# EAGLE design greenshield (EAGLE 6.5.0)
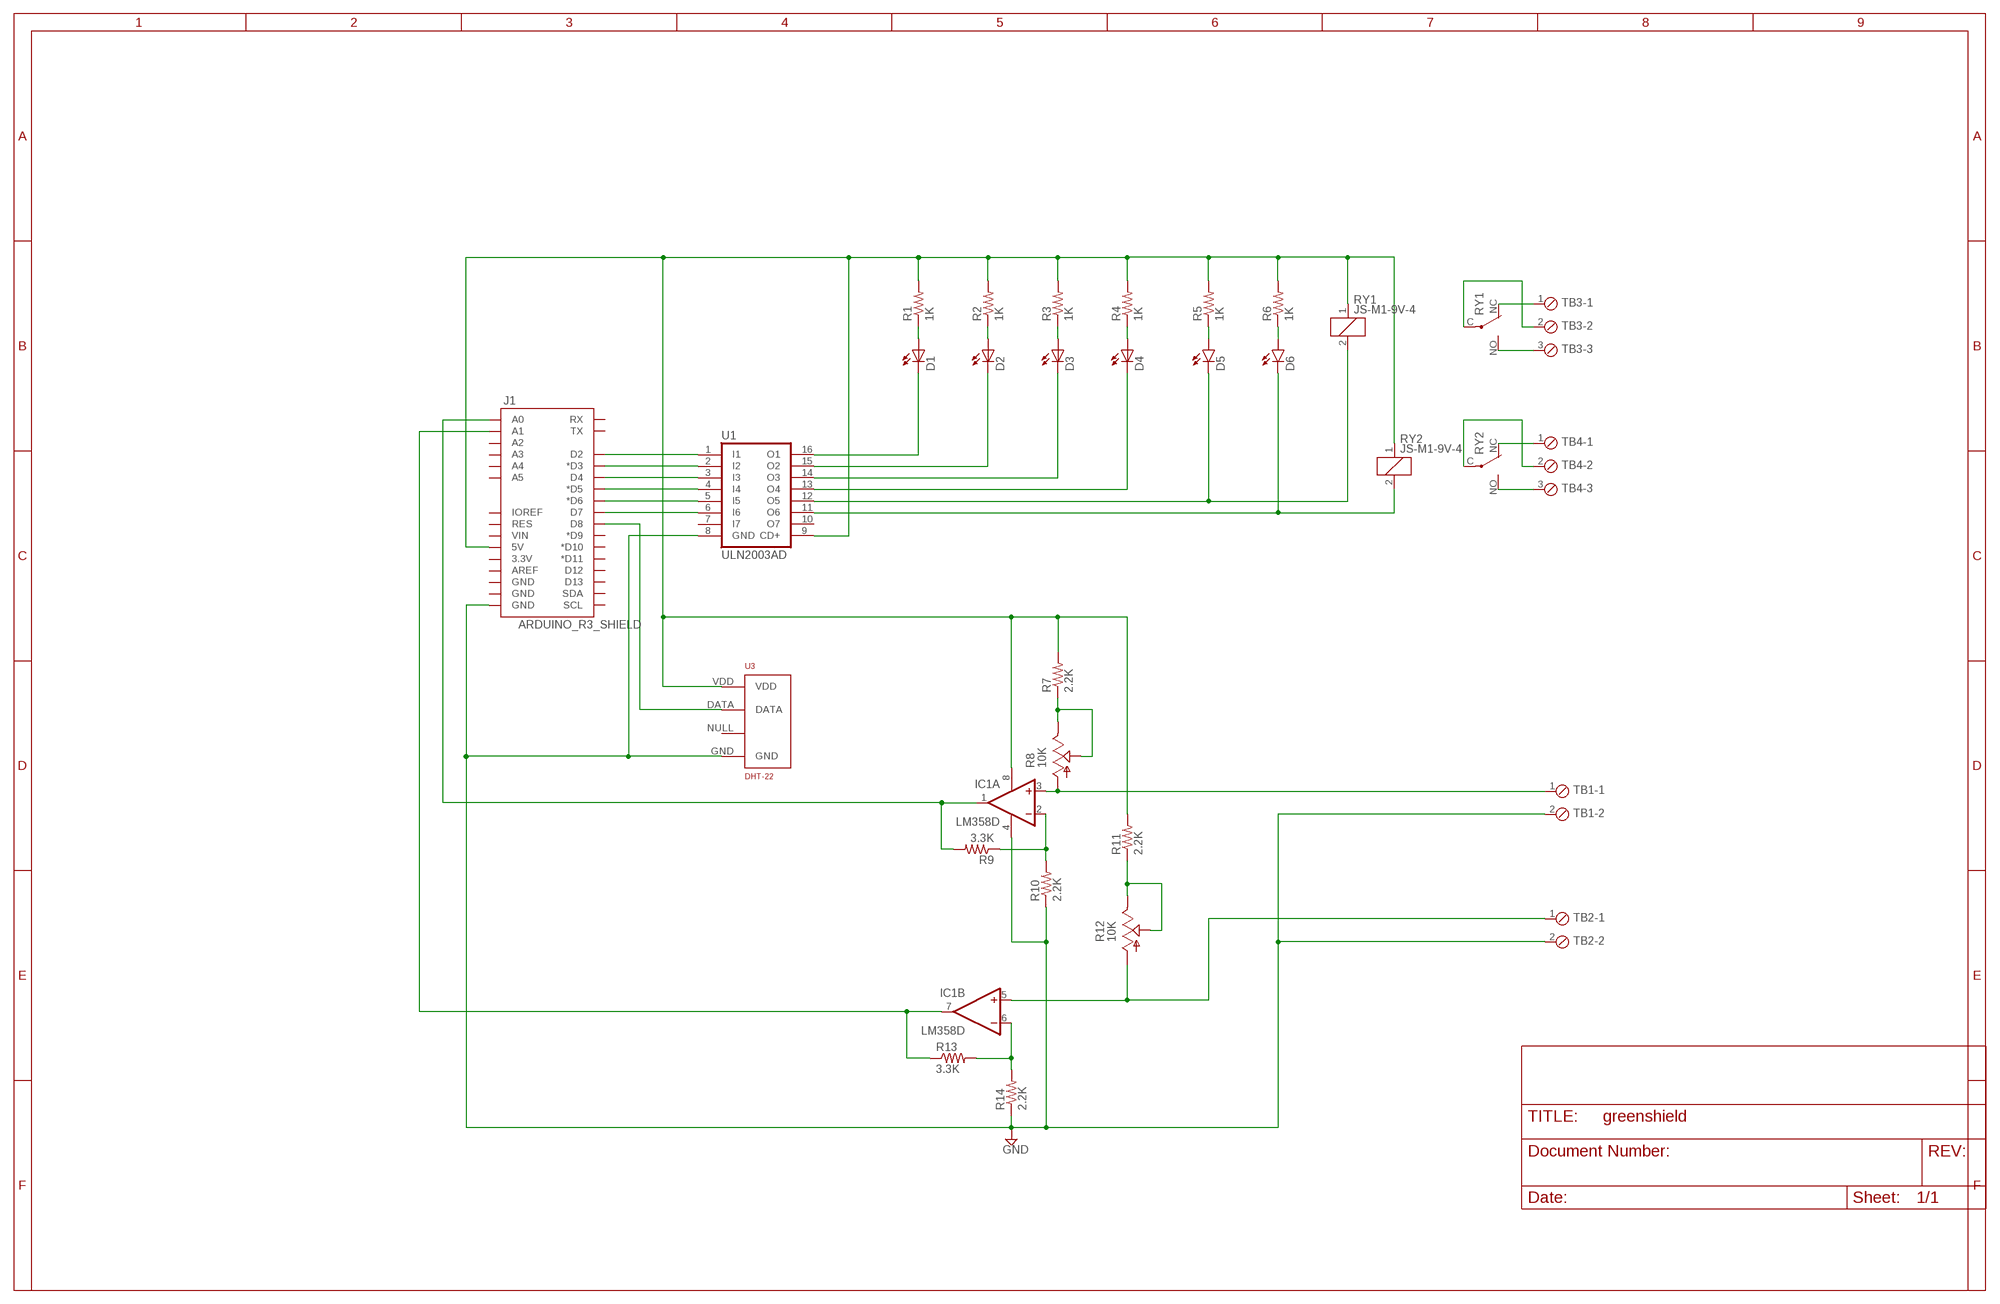
[diagram p0: schematic, sheet 1]

## Parts
D1  LED3MM  [LED3MM]
D2  LED3MM  [LED3MM]
D3  LED3MM  [LED3MM]
D4  LED3MM  [LED3MM]
D5  LED3MM  [LED3MM]
D6  LED3MM  [LED3MM]
IC1  LM358D  [SO08]
J1  ARDUINO_R3_SHIELD  [UNO_R3_SHIELD]
R1  1K  RESISTOR0805-RES  [0805]
R2  1K  RESISTOR0805-RES  [0805]
R3  1K  RESISTOR0805-RES  [0805]
R4  1K  RESISTOR0805-RES  [0805]
R5  1K  RESISTOR0805-RES  [0805]
R6  1K  RESISTOR0805-RES  [0805]
R7  2.2K  RESISTOR0805-RES  [0805]
R8  10K  TRIM_US-S64W  [S64W]
R9  3.3K  RESISTOR0805-RES  [0805]
R10  2.2K  RESISTOR0805-RES  [0805]
R11  2.2K  RESISTOR0805-RES  [0805]
R12  10K  TRIM_US-S64W  [S64W]
R13  3.3K  RESISTOR0805-RES  [0805]
R14  2.2K  RESISTOR0805-RES  [0805]
RY1  JS-M1-9V-4  [JS-M]
RY2  JS-M1-9V-4  [JS-M]
TB1  MPT2  [2POL254]
TB2  MPT2  [2POL254]
TB3  MPT3  [3POL254]
TB4  MPT3  [3POL254]
U1  ULN2003AD  [SO16]
U3  DHT-22  RHT03_DHT-22_AM2302  [RHT03_DHT-22]

## Nets
GND: IC1.4(P:V-) J1.GND@0(GND) R10.1 R14.1 TB1.2 TB2.2 U1.8(GND) U3.GND
N$1: J1.D2 U1.1(I1)
N$2: J1.D3(*D3) U1.2(I2)
N$3: J1.D4 U1.3(I3)
N$4: D6.K(C) RY2.2 U1.11(O6)
N$5: J1.D5(*D5) U1.4(I4)
N$6: J1.D6(*D6) U1.5(I5)
N$7: J1.D7 U1.6(I6)
N$8: D5.K(C) RY1.2 U1.12(O5)
N$9: RY1.NC(2:O) TB3.1
N$10: D1.K(C) U1.16(O1)
N$11: D6.A R6.1
N$12: D2.K(C) U1.15(O2)
N$13: D3.K(C) U1.14(O3)
N$14: D4.K(C) U1.13(O4)
N$15: D5.A R5.1
N$16: RY1.NO(2:S) TB3.3
N$17: D1.A R1.1
N$18: D2.A R2.1
N$19: D3.A R3.1
N$20: D4.A R4.1
N$21: RY2.NC(2:O) TB4.1
N$22: RY2.NO(2:S) TB4.3
N$23: RY2.C(2:P) TB4.2
N$24: RY1.C(2:P) TB3.2
N$25: IC1.8(P:V+) J1.5V R1.2 R2.2 R3.2 R4.2 R5.2 R6.2 R7.2 R11.2 RY1.1 RY2.1 U1.9(CD+) U3.VDD
N$26: R7.1 R8.E R8.S
N$27: R11.1 R12.E R12.S
N$28: IC1.5(B:+IN) R12.A TB2.1
N$29: IC1.6(B:-IN) R13.2 R14.2
N$30: IC1.7(B:OUT) J1.A1 R13.1
N$31: J1.D8 U3.DATA
N$32: IC1.2(A:-IN) R9.1 R10.2
N$33: IC1.1(A:OUT) J1.A0 R9.2
N$34: IC1.3(A:+IN) R8.A TB1.1
Unconnected: J1.3.3V J1.A2 J1.A3 J1.A4 J1.A5 J1.AREF J1.D9(*D9) J1.D10(*D10) J1.D11(*D11) J1.D12 J1.D13 J1.GND@1(GND) J1.GND@2(GND) J1.IOREF J1.RES J1.RX J1.SCL J1.SDA J1.TX J1.VIN U1.7(I7) U1.10(O7) U3.NULL

## Library data of the parts
D1-D4 = led:LED: LED OSRAM: - CHIPLED LG R971, LG N971, LY N971, LG Q971, LY Q971, LO R971, LY R971 LH N974, LH R974 LS Q976, LO Q976, LY Q976 LO Q996 - Hyper CHIPLED LW Q18S LB Q993, LB Q99A, LB R99A - SideLED LS A670, LO A670, LY A670, LG A670, LP A670 LB A673, LV A673, LT A673, LW A673 LH A674 LY A675 LS A676, LA A676, LO A676, LY A676, LW A676 LS A679, LY A679, LG A679 - Hyper Micro SIDELED® LS Y876, LA Y876, LO Y876, LY Y876 LT Y87S - SmartLED LW L88C, LW L88S LB L89C, LB L89S, LG L890 LS L89K, LO L89K, LY L89K LS L896, LA L896, LO L896, LY L896 - TOPLED LS T670, LO T670, LY T670, LG T670, LP T670 LSG T670, LSP T670, LSY T670, LOP T670, LYG T670 LG T671, LOG T671, LSG T671 LB T673, LV T673, LT T673, LW T673 LH T674 LS T676, LA T676, LO T676, LY T676, LB T676, LH T676, LSB T676, LW T676 LB T67C, LV T67C, LT T67C, LS T67K, LO T67K, LY T67K, LW E67C LS E67B, LA E67B, LO E67B, LY E67B, LB E67C, LV E67C, LT E67C LW T67C LS T679, LY T679, LG T679 LS T770, LO T770, LY T770, LG T770, LP T770 LB T773, LV T773, LT T773, LW T773 LH T774 LS E675, LA E675, LY E675, LS T675 LS T776, LA T776, LO T776, LY T776, LB T776 LHGB T686 LT T68C, LB T68C - Hyper Mini TOPLED® LB M676 - Mini TOPLED Santana® LG M470 LS M47K, LO M47K, LY M47K Source: http://www.osram.convergy.de LUXEON: - LUMILED® LXK2-PW12-R00, LXK2-PW12-S00, LXK2-PW14-U00, LXK2-PW14-V00 LXK2-PM12-R00, LXK2-PM12-S00, LXK2-PM14-U00 LXK2-PE12-Q00, LXK2-PE12-R00, LXK2-PE12-S00, LXK2-PE14-T00, LXK2-PE14-U00 LXK2-PB12-K00, LXK2-PB12-L00, LXK2-PB12-M00, LXK2-PB14-N00, LXK2-PB14-P00, LXK2-PB14-Q00 LXK2-PR12-L00, LXK2-PR12-M00, LXK2-PR14-Q00, LXK2-PR14-R00 LXK2-PD12-Q00, LXK2-PD12-R00, LXK2-PD12-S00 LXK2-PH12-R00, LXK2-PH12-S00 LXK2-PL12-P00, LXK2-PL12-Q00, LXK2-PL12-R00 Source: www.luxeon.com KINGBRIGHT: KA-3528ASYC Source: www.kingbright.com
D5 D6 = SparkFun-LED:LED: LEDs Standard schematic elements and footprints for 5mm, 3mm, 1206, and 0603 sized LEDs. 5mm - Spark Fun Electronics SKU : COM-00529 (and others)
IC1 = linear:LM358: OP AMP also LM158; LM258; LM2904 Source: http://cache.national.com/ds/LM/LM158.pdf
J1 = SparkFun-Boards:ARDUINO_R3_SHIELD: Shield form compatible with the Arduino Uno R3.
R1-R7 R9-R11 R13 R14 = SparkFun-Passives:RESISTOR: Resistor Basic schematic elements and footprints for 0603, 1206, and PTH resistors.
R8 R12 = pot:TRIM_US-: POTENTIOMETER
RY1 RY2 = relay:JS-M1*: Automotive Ultra-Miniature Power Relay NAiS Source: http://www.mew-europe.com/.. en_ds_61211_0000.pdf; OC_FARNELL: unknown; OC_NEWARK: unknown
TB1 TB2 = con-phoenix-254:MPT2: PHOENIX CONNECTOR; OC_FARNELL: unknown; OC_NEWARK: unknown
TB3 TB4 = con-phoenix-254:MPT3: PHOENIX CONNECTOR; OC_FARNELL: unknown; OC_NEWARK: unknown
U1 = uln-udn:ULN2003A: DRIVER ARRAY
U3 = RHT03_DHT-22_AM2302:RHT03_DHT-22_AM2302: RHT03 / DHT-22 / AM2302 Packages and symbol for the RHT03 / DHT-22 relative humidity and temperature sensor. Note: The AM2302 is a wired version of the DHT-22 which typically requires less clearance and is thus provided as a separate package.; PROD_ID: SEN-10167

## Board
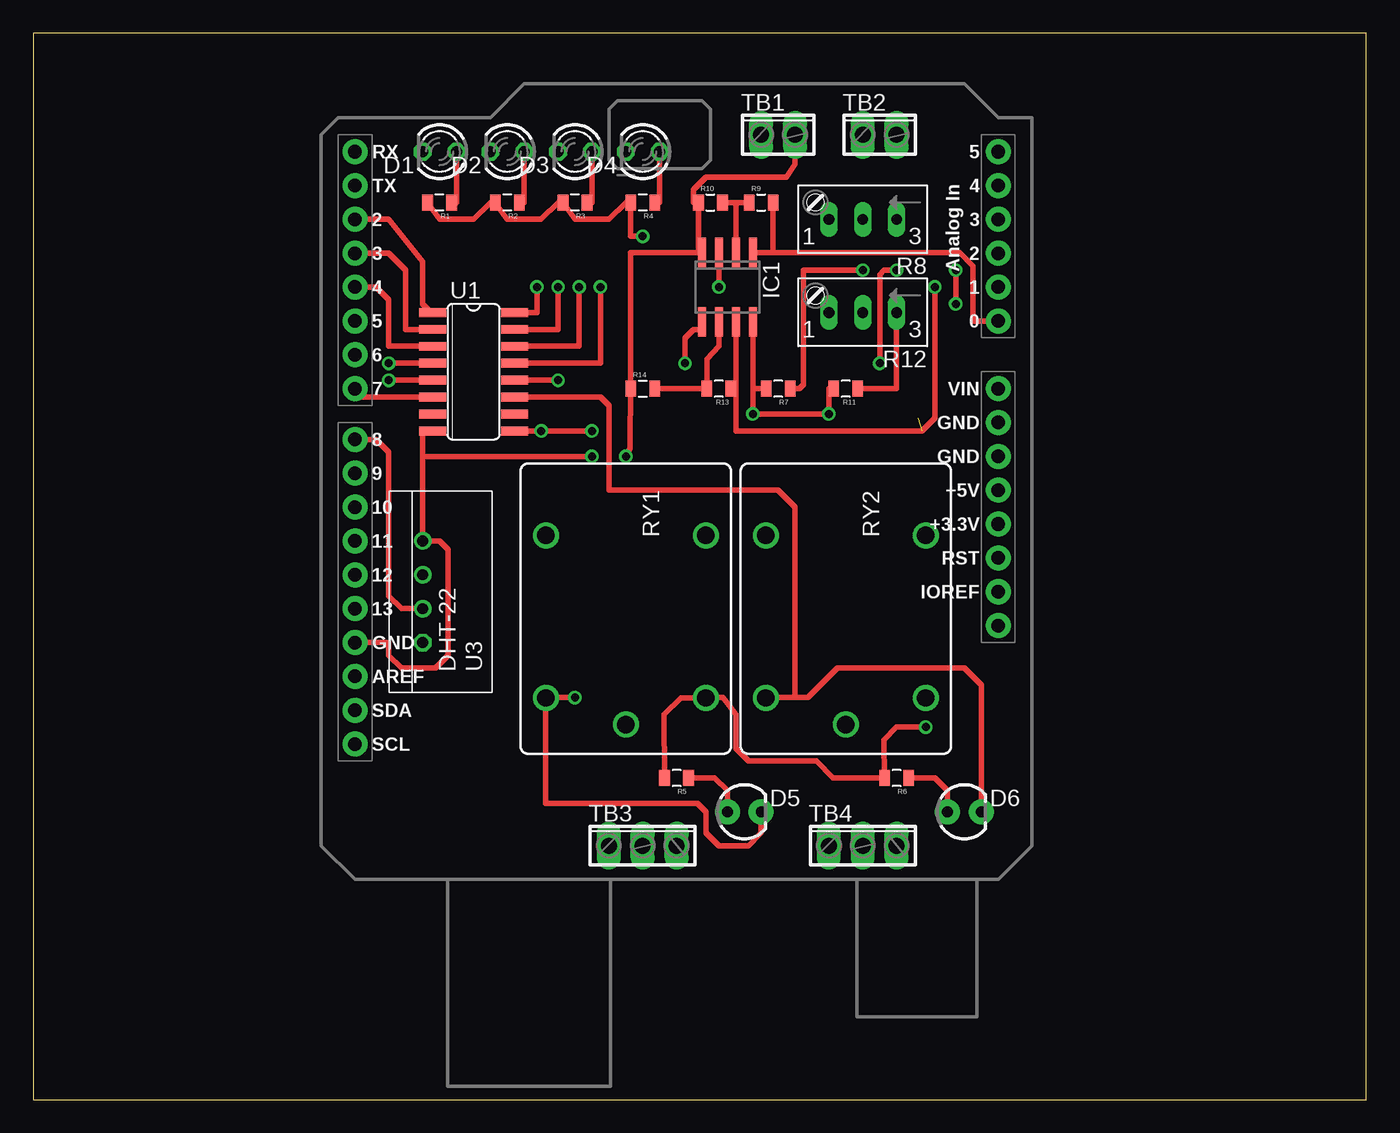
[diagram p1: board, top side]
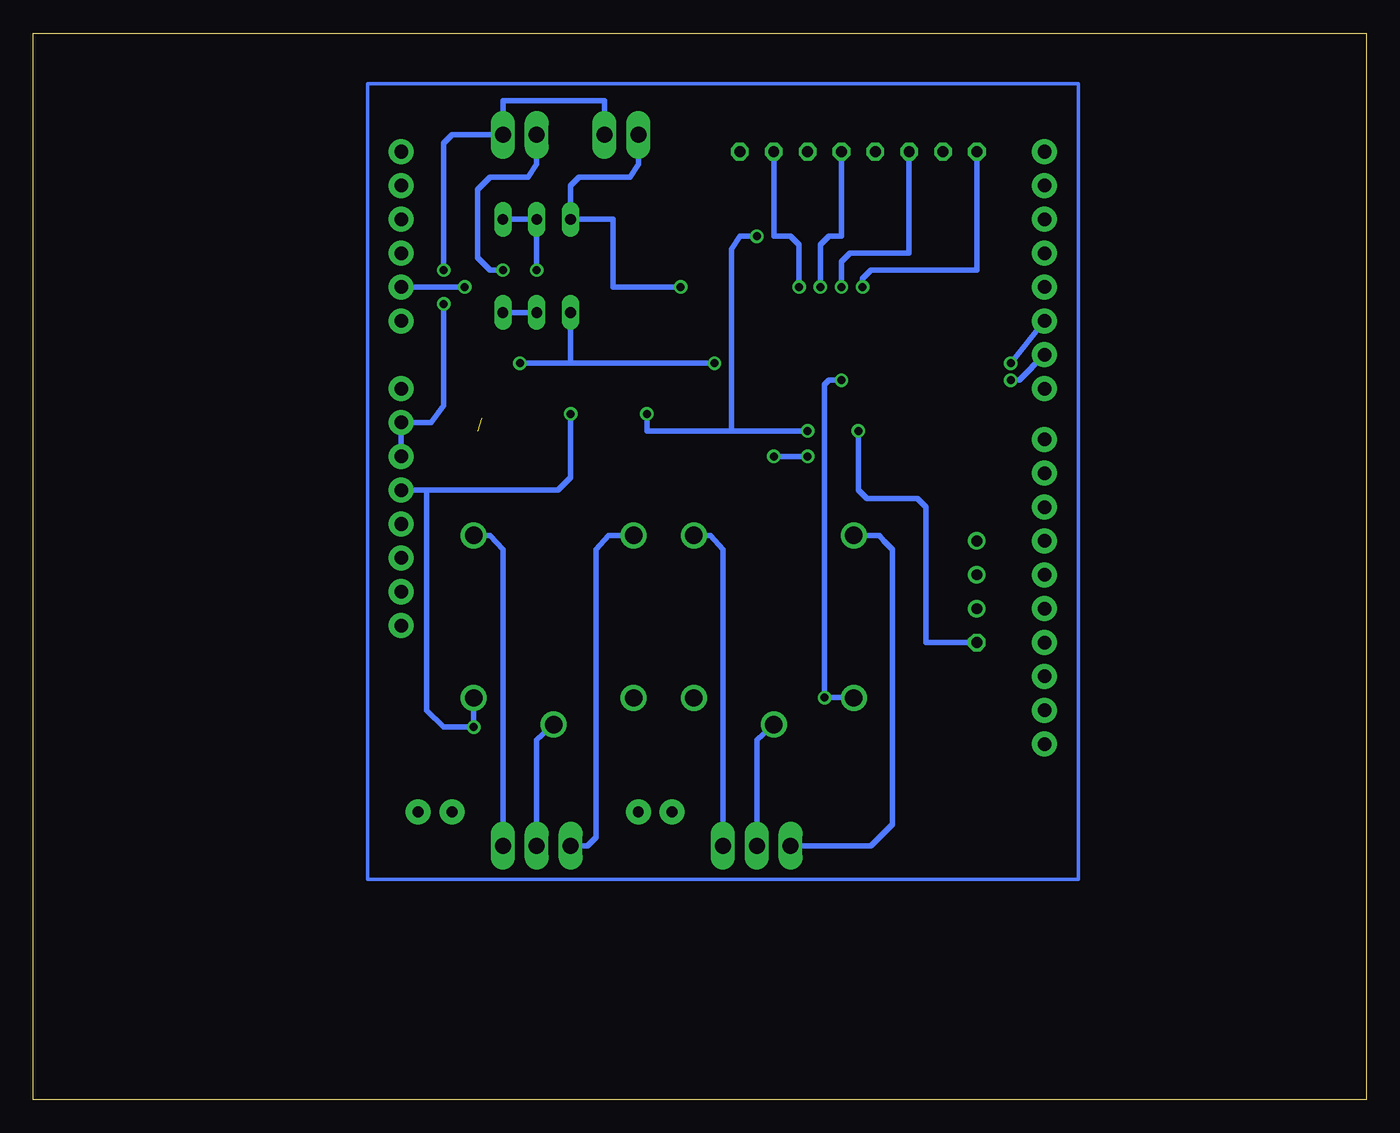
[diagram p2: board, bottom side, seen from below]

Size 100 x 80 mm. Coordinates in mm from the lower left corner, seen from the top.
Outline: 0,0 100,0 100,80 0,80 0,0
Copper layers (1*16): Top 0.035mm / dielectric 1.5mm / Bottom 0.035mm
Design rules "default": minimum track width 10mil, minimum drill 24mil, track to track 8mil, track to pad 8mil, pad to pad 8mil, via to via 8mil, smd to smd 8mil, copper to edge 40mil, drill to drill 8mil, minimum pad ring 10mil, minimum via ring 8mil, stop-mask expansion 4mil, vias tented up to drill 0mil, thermal gap 10mil

### Footprints (pad centres in the part's own frame; a part is rotated, then mirrored left to right if it is on the bottom)
LED3MM = drill 0.813 octagon: A -1.27,0; K 1.27,0
LED3MM' = drill 0.813 pad 1.88: A -1.27,0; K 1.27,0
SO08 = smd 0.6 x 2.2: 1 -1.905,-2.6; 2 -0.635,-2.6; 3 0.635,-2.6; 4 1.905,-2.6; 5 1.905,2.6; 6 0.635,2.6; 7 -0.635,2.6; 8 -1.905,2.6
UNO_R3_SHIELD = drill 1.016 pad 1.88: 3.3V 50.8,26.67; 5V 50.8,29.21; A0 50.8,41.91; A1 50.8,44.45; A2 50.8,46.99; A3 50.8,49.53; A4 50.8,52.07; A5 50.8,54.61; AREF 2.54,15.24; D2 2.54,49.53; D3 2.54,46.99; D4 2.54,44.45; D5 2.54,41.91; D6 2.54,39.37; D7 2.54,36.83; D8 2.54,33.02; D9 2.54,30.48; D10 2.54,27.94; D11 2.54,25.4; D12 2.54,22.86; D13 2.54,20.32; GND@0 50.8,31.75; GND@1 50.8,34.29; GND@2 2.54,17.78; IOREF 50.8,21.59; NC 50.8,19.05; RES 50.8,24.13; RX 2.54,54.61; SCL 2.54,10.16; SDA 2.54,12.7; TX 2.54,52.07; VIN 50.8,36.83
0805 = smd 0.8 x 1.2: 1 -0.9,0; 2 0.9,0
S64W = drill 0.813 long: A 2.54,1.27; E -2.54,1.27; S 0,1.27
JS-M = drill 1.3: 1 6.7,6; 2 6.7,-6; C 8.7,0; NC -5.5,-6; NO -5.5,6
2POL254 = drill 1.2 long: 1 -1.27,0; 2 1.27,0
3POL254 = drill 1.2 long: 1 -2.54,0; 2 0,0; 3 2.54,0
SO16 = smd 0.66 x 2.032: 1 -4.445,-3.073; 2 -3.175,-3.073; 3 -1.905,-3.073; 4 -0.635,-3.073; 5 0.635,-3.073; 6 1.905,-3.073; 7 3.175,-3.073; 8 4.445,-3.073; 9 4.445,3.073; 10 3.175,3.073; 11 1.905,3.073; 12 0.635,3.073; 13 -0.635,3.073; 14 -1.905,3.073; 15 -3.175,3.073; 16 -4.445,3.073
RHT03_DHT-22 = drill 0.8: DATA -1.27,0; GND 3.81,0; NULL 1.27,0 | drill 0.8 octagon: VDD -3.81,0

### Placement (x,y rotation side)
D1  30.48,71.12 180 top
D2  35.56,71.12 180 top
D3  40.64,71.12 180 top
D4  45.72,71.12 180 top
D5  [LED3MM']  53.34,21.59 0 top
D6  [LED3MM']  69.85,21.59 0 top
IC1  52.07,60.96 180 top
J1  21.59,16.51 0 top
R1  30.48,67.31 180 top
R2  35.56,67.31 180 top
R3  40.64,67.31 180 top
R4  45.72,67.31 180 top
R5  48.26,24.13 180 top
R6  64.77,24.13 180 top
R7  55.88,53.34 180 top
R8  62.23,67.31 180 top
R9  54.61,67.31 0 top
R10  50.8,67.31 0 top
R11  60.96,53.34 180 top
R12  62.23,60.33 180 top
R13  51.44,53.34 180 top
R14  45.72,53.34 0 top
RY1  44.45,36.83 270 top
RY2  60.96,36.83 270 top
TB1  55.88,72.39 0 top
TB2  63.5,72.39 0 top
TB3  45.72,19.05 0 top
TB4  62.23,19.05 0 top
U1  33.02,54.61 270 top
U3  29.21,38.1 90 top

### Tracks (layer width: path | path; a pad name or v marks a point on that pad's centre or on a via)
GND  (via drill 0.6)
  Top 0.406: 24.13,34.29 26.67,34.29 26.67,33.34 27.62,32.38 30.16,32.38 31.11,33.34 31.11,41.27 30.48,41.91 U3.GND 29.21,48.26 | IC1.4 49.9,63.56 | 49.9,63.56 R10.1 49.53,67.31 49.53,68.26 50.48,69.22 56.52,69.22 57.15,70.17 TB1.2 | 49.9,63.56 44.82,63.56 R14.1 44.77,49.21 44.77,48.9 v44.45,48.26 | U1.8 29.21,50.16 29.21,48.26 | 29.21,48.26 v41.91,48.26 | v69.22,59.69 v69.22,62.23
  Bottom 0.406: TB1.2 57.15,74.93 64.77,74.93 TB2.2 68.58,72.39 69.22,71.75 v69.22,62.23 | v41.91,48.26 v44.45,48.26 | J1.GND@0 72.39,50.8 70.17,50.8 69.22,52.07 v69.22,59.69
N$1
  Top 0.406: U1.1 29.84,59.05 29.21,59.69 29.21,62.87 26.67,66.04 J1.D2
N$2
  Top 0.406: U1.2 27.94,57.78 27.94,62.23 26.67,63.5 J1.D3
N$3
  Top 0.406: U1.3 26.67,56.52 26.67,60.01 25.72,60.96 J1.D4
N$4
  Top 0.406: U1.11 42.55,52.7 43.18,52.07 43.18,45.72 55.88,45.72 57.15,44.45 57.15,30.16 | 57.15,30.16 54.96,30.16 RY2.2 | D6.K 71.12,31.11 69.85,32.38 60.33,32.38 58.1,30.16 57.15,30.16
N$5  (via drill 0.6)
  Top 0.406: U1.4 v26.67,55.24
  Bottom 0.406: v26.67,55.24 J1.D5
N$6  (via drill 0.6)
  Top 0.406: U1.5 v26.67,53.98
  Bottom 0.406: v26.67,53.98 26.04,53.98 J1.D6
N$7
  Top 0.406: U1.6 24.13,52.7 J1.D7
N$8  (via drill 0.6)
  Top 0.406: U1.12 v39.37,53.98 | v40.64,30.16 38.42,30.16 38.42,22.23 49.85,22.23 50.48,21.59 50.48,20 51.44,19.05 53.66,19.05 54.61,20 D5.K
  Bottom 0.406: v39.37,53.98 40.32,53.98 40.64,53.66 v40.64,30.16 38.45,30.16 RY1.2
N$9
  Bottom 0.406: RY1.NC 36.51,42.33 36.2,41.91 35.56,41.27 35.56,20.64 37.15,19.05 TB3.1
N$10  (via drill 0.6)
  Top 0.406: U1.16 37.78,59.05 v37.78,60.96
  Bottom 0.406: v37.78,60.96 37.78,61.59 37.15,62.23 29.21,62.23 D1.K
N$11
  Top 0.406: R6.1 67.63,24.13 68.58,23.18 D6.A
N$12  (via drill 0.6)
  Top 0.406: U1.15 39.37,57.78 v39.37,60.96
  Bottom 0.406: v39.37,60.96 39.37,62.87 38.73,63.5 34.29,63.5 D2.K
N$13  (via drill 0.6)
  Top 0.406: U1.14 40.96,56.52 v40.96,60.96
  Bottom 0.406: v40.96,60.96 40.96,64.14 40.32,64.77 39.37,64.77 D3.K
N$14  (via drill 0.6)
  Top 0.406: U1.13 42.55,55.24 v42.55,60.96
  Bottom 0.406: v42.55,60.96 42.55,64.14 43.18,64.77 44.45,64.77 D4.K
N$15
  Top 0.406: R5.1 51.12,24.13 52.07,23.18 D5.A
N$16
  Bottom 0.406: RY1.NO 49.21,42.33 48.26,41.27 TB3.3
N$17
  Top 0.406: R1.1 31.75,67.31 D1.A
N$18
  Top 0.406: R2.1 36.83,67.31 D2.A
N$19
  Top 0.406: R3.1 41.91,67.31 D3.A
N$20
  Top 0.406: R4.1 46.99,67.31 D4.A
N$21
  Bottom 0.406: RY2.NC 56.83,42.33 57.78,41.27 57.78,19.68 58.42,19.05 TB4.1
N$22
  Bottom 0.406: RY2.NO 65.72,42.33 64.77,41.27 TB4.3
N$23
  Bottom 0.406: RY2.C 62.23,26.99 TB4.2
N$24
  Bottom 0.406: RY1.C 45.72,26.99 TB3.2
N$25  (via drill 0.6)
  Top 0.406: R1.2 30.48,66.04 33.02,66.04 34.29,67.31 R2.2 35.56,66.04 38.1,66.04 39.37,67.31 R3.2 40.64,66.04 43.18,66.04 44.45,67.31 R4.2 44.82,64.77 v45.72,64.77 | v66.96,27.94 64.77,27.94 63.82,26.99 R6.2 60.01,24.13 58.74,25.4 53.66,25.4 52.7,26.35 52.7,28.89 51.75,30.16 50.45,30.16 RY1.1 48.58,30.13 47.31,28.89 R5.2 | IC1.8 53.98,53.34 | R11.2 59.69,53.34 v59.69,51.44 v53.98,51.44 53.98,53.34 | U1.9 v38.1,50.16 v41.91,50.16 | R7.2 53.98,53.34
  Bottom 0.406: RY2.1 v66.96,27.94 69.22,27.94 70.48,29.21 70.48,45.72 J1.5V 60.64,45.72 59.69,46.67 v59.69,51.44 | v53.98,51.44 53.98,50.16 47.62,50.16 | 47.62,50.16 47.62,63.82 46.99,64.77 v45.72,64.77 | v38.1,50.16 38.1,45.72 37.47,45.09 33.66,45.09 33.02,44.45 33.02,34.29 U3.VDD | v41.91,50.16 47.62,50.16
N$26  (via drill 0.6)
  Top 0.406: R7.1 57.47,53.34 57.78,53.66 57.78,62.23 v62.23,62.23
  Bottom 0.406: R8.E R8.S v62.23,62.23
N$27
  Top 0.406: R12.E 64.77,53.34 R11.1
  Bottom 0.406: R12.S R12.E
N$28  (via drill 0.6)
  Top 0.406: v48.9,55.24 48.9,57.15 49.53,57.78 50.16,57.78 IC1.5 | v63.5,55.24 63.5,61.91 63.82,62.23 v64.77,62.23
  Bottom 0.406: 59.69,55.24 v48.9,55.24 | R12.A 59.69,55.24 | 59.69,55.24 v63.5,55.24 | v64.77,62.23 65.72,62.23 66.67,63.18 66.67,68.26 65.72,69.22 62.87,69.22 62.23,70.17 TB2.1
N$29
  Top 0.406: IC1.6 51.44,56.52 50.53,55.56 R13.2 R14.2
N$30  (via drill 0.6)  (1 unrouted)
  Top 0.406: 52.7,53.34 R13.1 | IC1.7 52.7,53.34 | 52.7,53.34 52.7,50.16 66.67,50.16 67.63,51.12 v67.63,60.96
  Bottom 0.406: v67.63,60.96 J1.A1
N$31
  Top 0.406: U3.DATA 27.62,36.83 26.67,37.78 26.67,48.58 25.72,49.53 J1.D8
N$32
  Top 0.406: IC1.2 52.7,67.31 | 52.7,67.31 R10.2 | R9.1 52.7,67.31
N$33
  Top 0.406: IC1.1 55.51,63.56 | 55.51,63.56 R9.2 | 55.51,63.56 69.53,63.56 70.48,62.55 70.48,58.42 J1.A0
N$34  (via drill 0.6)
  Top 0.406: v51.44,60.96 IC1.3
  Bottom 0.406: TB1.1 54.61,70.17 55.24,69.22 59.05,69.22 59.69,68.58 R8.A 56.52,66.04 56.52,60.96 v51.44,60.96
N$35
  Bottom 0.254: 21.59,76.2 21.59,16.51 74.93,16.51 74.93,76.2 21.59,76.2